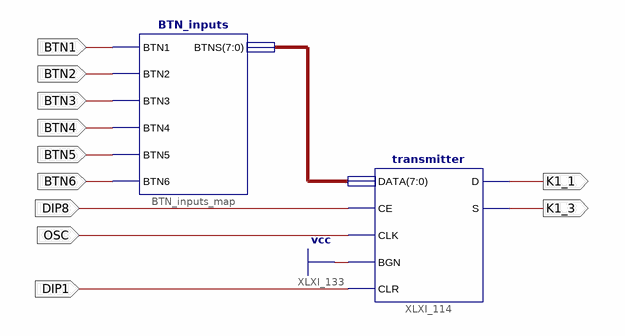
[diagram p0: schematic sheet 1]
// Xilinx ISE schematic main.sch (spartan6) as structural Verilog: 2 symbols, 11 ports
module main (
  input  BTN1,
  input  BTN2,
  input  BTN3,
  input  BTN4,
  input  BTN5,
  input  BTN6,
  input  OSC,
  input  DIP8,
  input  DIP1,
  output K1_1,
  output K1_3
);

  wire [7:0] XLXN_287;

  transmitter XLXI_114 (.BGN(1'b1), .CE(DIP8), .CLK(OSC), .CLR(DIP1), .D(K1_1), .DATA(XLXN_287), .S(K1_3));
  BTN_inputs BTN_inputs_map (
    .BTN1(BTN1), .BTN2(BTN2), .BTN3(BTN3), .BTN4(BTN4), .BTN5(BTN5), .BTN6(BTN6), .BTNS(XLXN_287));
endmodule
